# EAGLE design observer (EAGLE 6.5.0)
AUTHOR: Brad Campbell; REV: A; TITLE: Observer
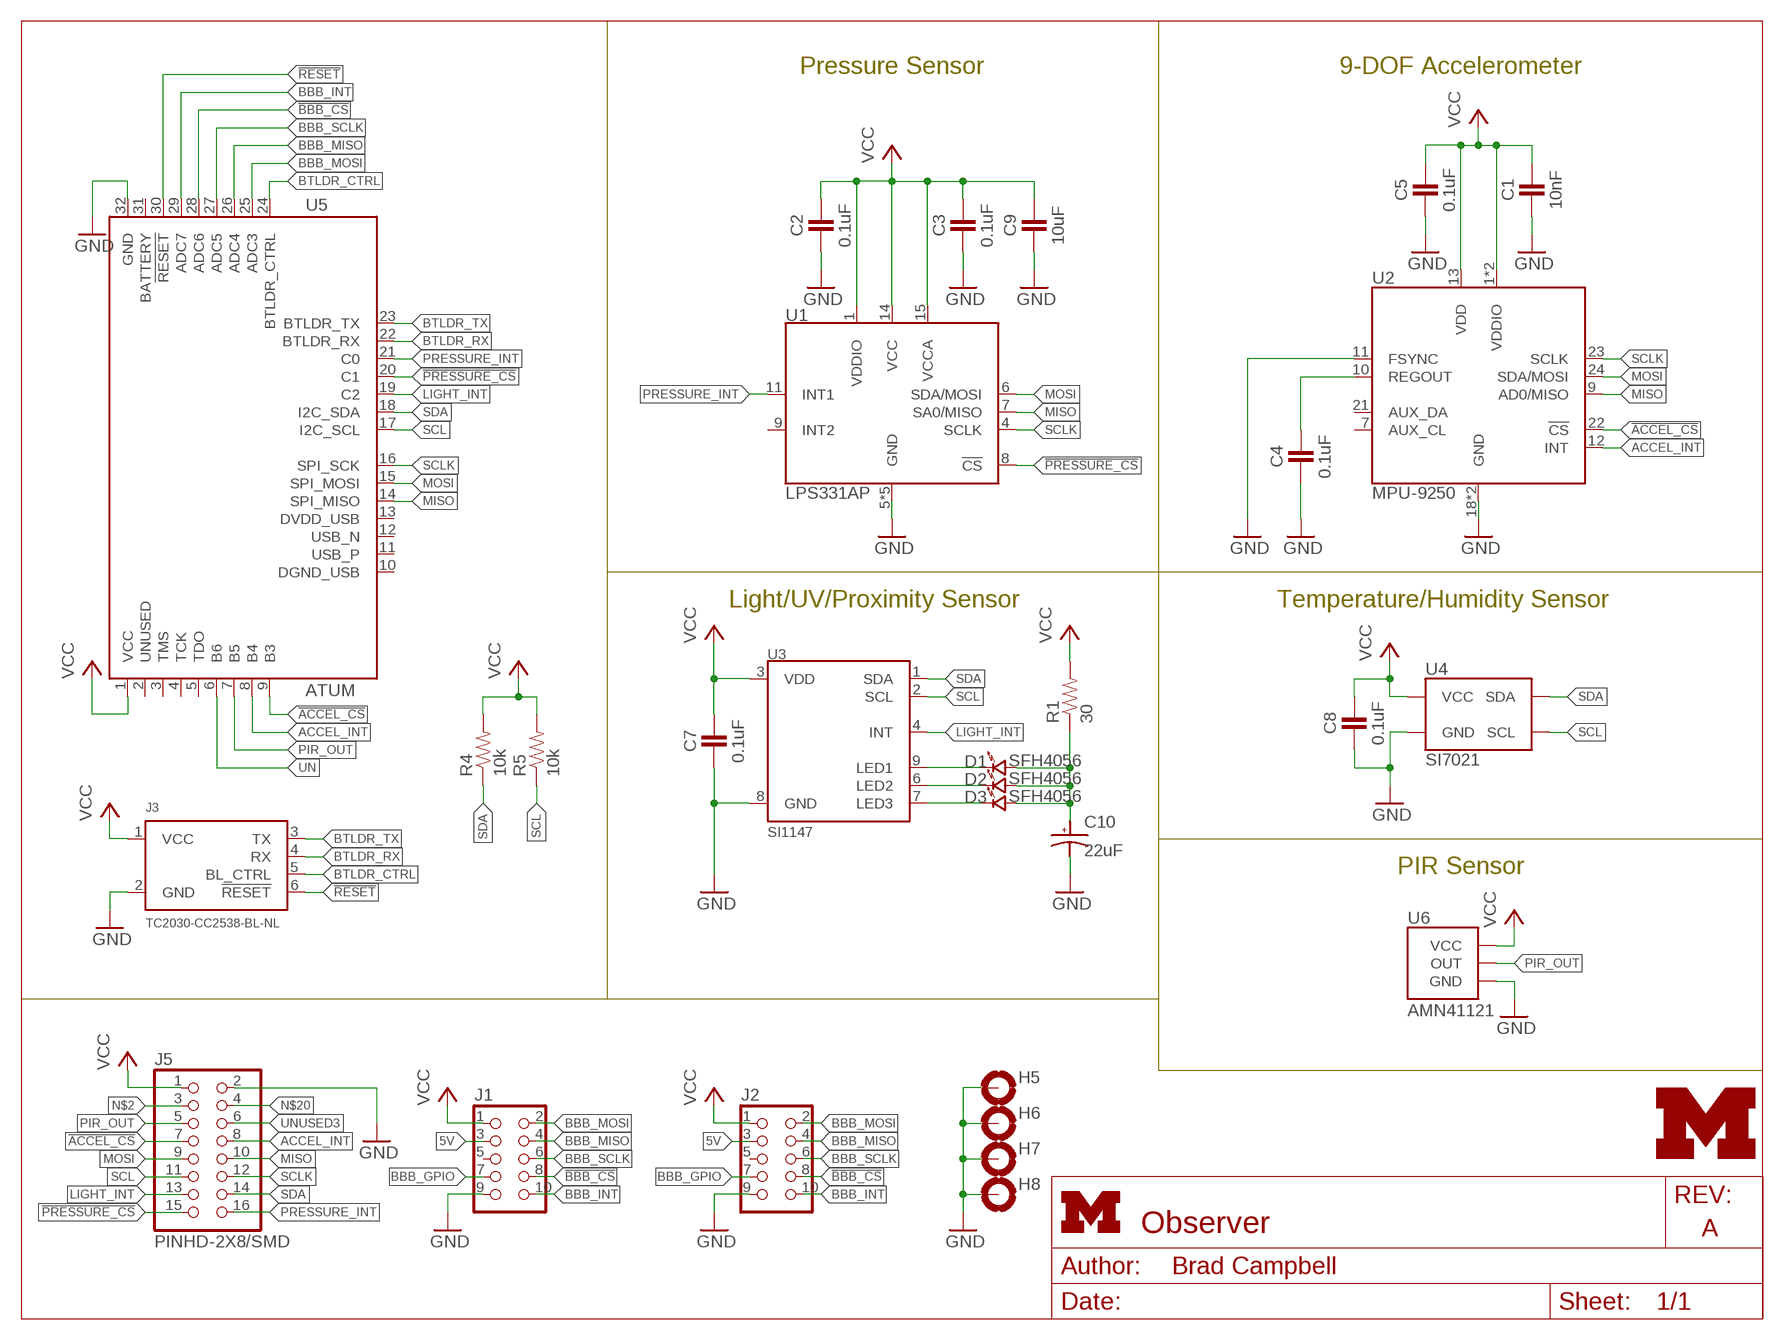
[diagram p0: schematic, sheet 1]
FRAME1 (LETTER_L): HEIGHT: 8.5in; WIDTH: 11in

## Parts
C1  10nF  CAPACITOR  [0402_CAP]
C2  0.1uF  CAPACITOR  [0402_CAP]
C3  0.1uF  CAPACITOR  [0402_CAP]
C4  0.1uF  CAPACITOR  [0402_CAP]
C5  0.1uF  CAPACITOR  [0402_CAP]
C7  0.1uF  CAPACITOR  [0402_CAP]
C8  0.1uF  CAPACITOR  [0402_CAP]
C9  10uF  CAPACITOR  [0402_CAP]
C10  22uF  CAP_POL0603  [CAP0603]
D1  SFH4056  [SFH4056]
D2  SFH4056  [SFH4056]
D3  SFH4056  [SFH4056]
H5  MOUNT-PAD-ROUND3.2  [3,2-PAD]
H6  MOUNT-PAD-ROUND3.2  [3,2-PAD]
H7  MOUNT-PAD-ROUND3.2  [3,2-PAD]
H8  MOUNT-PAD-ROUND3.2  [3,2-PAD]
J1  CON_HEADER_2X05-SMD+SHROUDED  [PINSHRD_SMT_2X05]
J2  CON_HEADER_2X05-SMD+SHROUDED  [PINSHRD_SMT_2X05]
J3  TC2030-CC2538-BL-NL  [TC2030-IDC-NL]
J5  PINHD-2X8/SMD  [2X8/SMD]
LOGO1  UMICH_SOLID_TINY  [UMICH_SOLID_50MIL]
R1  30  RESISTOR0402_RES  [0402_RES]
R4  10k  RESISTOR0402_RES  [0402_RES]
R5  10k  RESISTOR0402_RES  [0402_RES]
U1  LPS331AP  [HCLGA-16/3MM]
U2  MPU-9250  [QFN-24/3MM]
U3  SI1147  [QFN-10/2MM]
U4  SI7021  [DFN-6/3MM]
U5  ATUM  [ATUM]
U6  AMN41121  [AMN2]

## Nets
5V: J1.3 J2.3
!ACCEL_CS: J5.7 U2.22(!CS) U5.9(B3)
!BBB_CS: J1.8 J2.8 U5.28(ADC6)
!PRESSURE_CS: J5.15 U1.8(!CS) U5.20(C1)
!RESET: J3.6(!RESET) U5.30(!RESET)
ACCEL_INT: J5.8 U2.12(INT) U5.8(B4)
BBB_GPIO: J1.7 J2.7
BBB_INT: J1.10 J2.10 U5.29(ADC7)
BBB_MISO: J1.4 J2.4 U5.26(ADC4)
BBB_MOSI: J1.2 J2.2 U5.25(ADC3)
BBB_SCLK: J1.6 J2.6 U5.27(ADC5)
BTLDR_CTRL: J3.5(BL_CTRL) U5.24(BTLDR_CTRL)
BTLDR_RX: J3.4(RX) U5.22(BTLDR_RX)
BTLDR_TX: J3.3(TX) U5.23(BTLDR_TX)
GND: C1.2 C2.2 C3.2 C4.2 C5.2 C7.2 C8.2 C9.2 C10.NEG(ANODE) H5.B3,2(MOUNT) H6.B3,2(MOUNT) H7.B3,2(MOUNT) H8.B3,2(MOUNT) J1.9 J2.9 J3.2(GND) J5.2 U1.5(GND) U1.10(GND) U1.12(GND) U1.13(GND) U1.16(GND) U2.11(FSYNC) U2.18(GND) U2.20(GND) U3.8(GND) U4.2(GND) U5.32(GND) U6.GND
LIGHT_INT: J5.13 U3.4(INT) U5.19(C2)
MISO: J5.10 U1.7(SA0/MISO) U2.9(AD0/MISO) U5.14(SPI_MISO)
MOSI: J5.9 U1.6(SDA/MOSI) U2.24(SDA/MOSI) U5.15(SPI_MOSI)
N$2: J5.3
N$3: C4.1 U2.10(REGOUT)
N$4: D1.CATHODE U3.9(LED1)
N$6: D2.CATHODE U3.6(LED2)
N$7: D3.CATHODE U3.7(LED3)
N$8: C10.POS(CATHODE) D1.ANODE D2.ANODE D3.ANODE R1.1
N$20: J5.4
PIR_OUT: J5.5 U5.7(B5) U6.OUT
PRESSURE_INT: J5.16 U1.11(INT1) U5.21(C0)
SCL: J5.11 R5.1 U3.2(SCL) U4.6(SCL) U5.17(I2C_SCL)
SCLK: J5.12 U1.4(SCLK) U2.23(SCLK) U5.16(SPI_SCK)
SDA: J5.14 R4.1 U3.1(SDA) U4.1(SDA) U5.18(I2C_SDA)
UN: U5.6(B6)
UNUSED3: J5.6
VCC: C1.1 C2.1 C3.1 C5.1 C7.1 C8.1 C9.1 J1.1 J2.1 J3.1(VCC) J5.1 R1.2 R4.2 R5.2 U1.1(VDDIO) U1.14(VCC) U1.15(VCCA) U2.1(VDDIO) U2.8(VDDIO) U2.13(VDD) U3.3(VDD) U4.5(VCC) U5.1(VCC) U6.VCC
Unconnected: J1.5 J2.5 U1.9(INT2) U2.7(AUX_CL) U2.21(AUX_DA) U5.2(UNUSED) U5.3(TMS) U5.4(TCK) U5.5(TDO) U5.10(DGND_USB) U5.11(USB_P) U5.12(USB_N) U5.13(DVDD_USB) U5.31(BATTERY)

## Notes on the sheet
- Pressure Sensor | 9-DOF Accelerometer
- Light/UV/Proximity Sensor | Temperature/Humidity Sensor
- PIR Sensor

## Library data of the parts
C1 = passives:CAPACITOR: 0402 Capacitor; DIGIKEY: 490-1312-1-ND
C2-C5 C7 C8 = passives:CAPACITOR: 0402 Capacitor; DIGIKEY: 490-1318-1-ND
C9 = passives:CAPACITOR: 0402 Capacitor; DIGIKEY: 445-8919-1-ND
C10 = passives:CAP_POL; DIGIKEY: 511-1493-1-ND
D1-D3 = leds:SFH4056: LED IR EMITTER 850NM; DIGIKEY: 475-3042-1-ND
H5-H8 = holes:MOUNT-PAD-ROUND: MOUNTING PAD, round
J1 J2 = dp_devices:CON_HEADER_2X05: 2x05 pin header; DIGIKEY: S9185-ND
J3 = connector:TC2030-CC2538-BL: Tag connect programmer for the CC2538 bootloader. The RX/TX switch happens on the programmer board, so when using this connect the TX pin to the TX pin on the CC2538 and same for the RX.
J5 = headers:PINHD-2X8/SMD
LOGO1 = logos:UMICH_SOLID
R1 = passives:RESISTOR: Resistor Basic schematic elements and footprints for 0603, 1206, and PTH resistors.; DIGIKEY: RHM30CECT-ND
R4 R5 = passives:RESISTOR: Resistor Basic schematic elements and footprints for 0603, 1206, and PTH resistors.; DIGIKEY: RHM10.0KCDCT-ND
U1 = chips:LPS331AP: IC PRESSURE SENSOR PIEZO 16HCLGA; DIGIKEY: 497-12927-1-ND
U2 = chips:MPU-9250: GYRO/ACCEL/COMPASS/9-AXIS; DIGIKEY: 1428-1019-1-ND
U3 = chips:SI1147: SENSOR DGTL UV INDEX 10QFN; DIGIKEY: 336-2624-1-ND
U4 = chips:SI7021: IC TEMP SENSOR RH 2% DFN; DIGIKEY: 336-2542-1-ND
U5 = atum:ATUM: Atum sensorboard prototyping module.
U6 = chips:AMN: Passive infrared human detection sensor with built-in amp.; DIGIKEY: 255-2651-ND

## Board
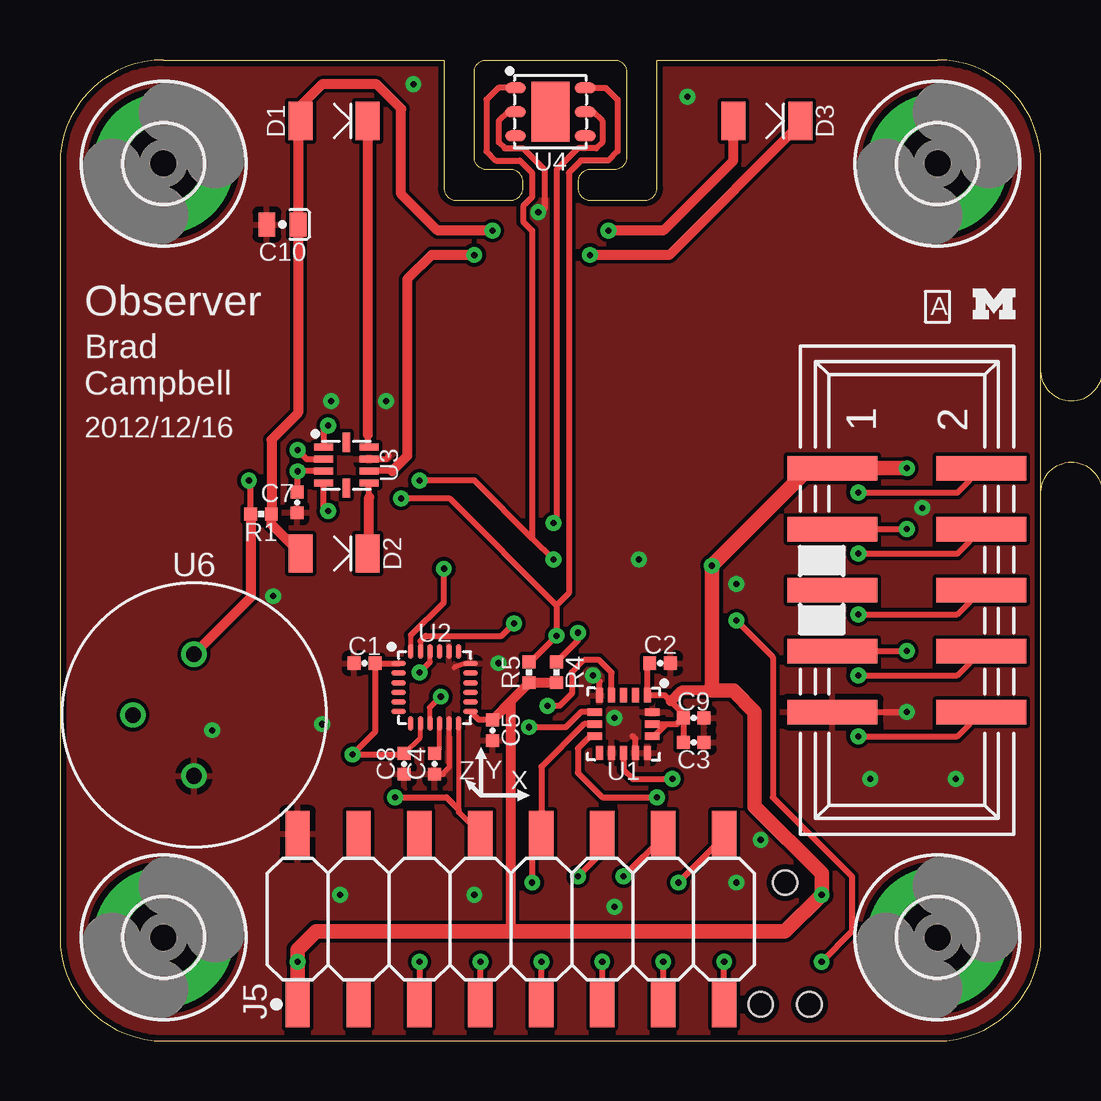
[diagram p1: board, top side]
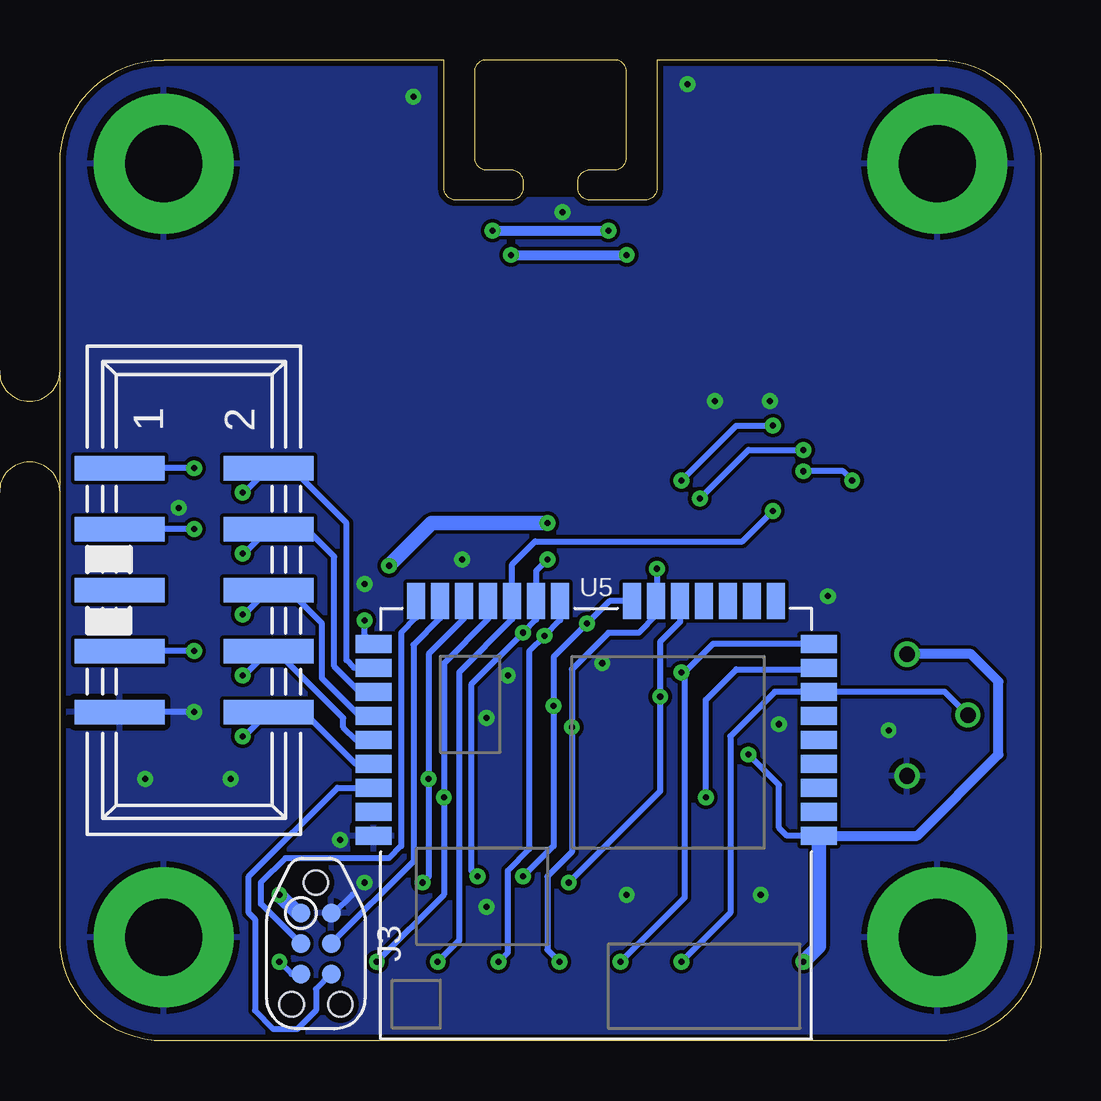
[diagram p2: board, bottom side, seen from below]

Size 40.89 x 40.89 mm. Coordinates in mm from the lower left corner, seen from the top.
Outline: 0,36.58 0,4.32 arc90 4.32,0 36.58,0 arc90 40.89,4.32 40.89,36.58 arc90 36.58,40.89 24.89,40.89 24.89,35.56 arc-90 24.38,35.05 22.1,35.05 arc-90 21.59,35.56 21.59,35.81 arc-90 22.1,36.32 23.11,36.32 arc90 23.62,36.83 23.62,40.39 arc90 23.11,40.89 17.78,40.89 arc90 17.27,40.39 17.27,36.83 arc90 17.78,36.32 18.8,36.32 arc-90 19.3,35.81 19.3,35.56 arc-90 18.8,35.05 16.51,35.05 arc-90 16,35.56 16,40.89 4.32,40.89 arc90 0,36.58
Copper layers (1*16): Top 0.0178mm / dielectric 59mil / Bottom 0.0178mm
Design rules "sunstone-2lyr_v1.0.0.3 *": minimum track width 6mil, minimum drill 14mil, track to track 6mil, track to pad 6mil, pad to pad 6mil, via to via 6mil, smd to smd 6mil, copper to edge 10mil, drill to drill 16mil, minimum pad ring 8mil, minimum via ring 8mil, stop-mask expansion 3mil, vias tented up to drill 20mil, thermal gap 10mil
Milling: 33 lines

### Footprints (pad centres in the part's own frame; a part is rotated, then mirrored left to right if it is on the bottom)
0402_CAP = smd 0.536 x 0.546: 1 -0.433,0; 2 0.433,0
CAP0603 = smd 0.7 x 1: NEG 0.65,0; POS -0.65,0
SFH4056 = smd 1 x 1.6: ANODE 1.4,0; CATHODE -1.4,0
3,2-PAD = drill 3.2 pad 5.842: B3,2 0,0
PINSHRD_SMT_2X05 = smd 1.02 x 3.75: 1 -5.08,-3.107; 2 -5.08,3.107; 3 -2.54,-3.107; 4 -2.54,3.107; 5 0,-3.107; 6 0,3.107; 7 2.54,-3.107; 8 2.54,3.107; 9 5.08,-3.107; 10 5.08,3.107
TC2030-IDC-NL = smd 0.787 x 0.787: 1 -1.27,-0.635; 2 -1.27,0.635; 3 0,-0.635; 4 0,0.635; 5 1.27,-0.635; 6 1.27,0.635 | hole 1.016: -2.54,0; 2.54,1.016; 2.54,-1.016
2X8/SMD = smd 1.016 x 1.905: 1 -8.89,-3.556; 2 -8.89,3.556; 3 -6.35,-3.556; 4 -6.35,3.556; 5 -3.81,-3.556; 6 -3.81,3.556; 7 -1.27,-3.556; 8 -1.27,3.556; 9 1.27,-3.556; 10 1.27,3.556; 11 3.81,-3.556; 12 3.81,3.556; 13 6.35,-3.556; 14 6.35,3.556; 15 8.89,-3.556; 16 8.89,3.556
0402_RES = smd 0.536 x 0.546: 1 -0.433,0; 2 0.433,0
HCLGA-16/3MM = smd 0.6 x 0.3: 1 -1.2,1; 2 -1.2,0.5; 3 -1.2,0; 4 -1.2,-0.5; 5 -1.2,-1; 9 1.2,-1; 10 1.2,-0.5; 11 1.2,0; 12 1.2,0.5; 13 1.2,1 | smd 0.3 x 0.6: 6 -0.5,-1.2; 7 0,-1.2; 8 0.5,-1.2; 14 0.5,1.2; 15 0,1.2; 16 -0.5,1.2
QFN-24/3MM = smd 0.6 x 0.23: 1 -1.5,1; 2 -1.5,0.6; 3 -1.5,0.2; 4 -1.5,-0.2; 5 -1.5,-0.6; 6 -1.5,-1; 13 1.5,-1; 14 1.5,-0.6; 15 1.5,-0.2; 16 1.5,0.2; 17 1.5,0.6; 18 1.5,1 | smd 0.23 x 0.6: 7 -1,-1.5; 8 -0.6,-1.5; 9 -0.2,-1.5; 10 0.2,-1.5; 11 0.6,-1.5; 12 1,-1.5; 19 1,1.5; 20 0.6,1.5; 21 0.2,1.5; 22 -0.2,1.5; 23 -0.6,1.5; 24 -1,1.5
QFN-10/2MM = smd 0.8 x 0.3: 1 -0.95,0.75; 2 -0.95,0.25; 3 -0.95,-0.25; 4 -0.95,-0.75; 6 0.95,-0.75; 7 0.95,-0.25; 8 0.95,0.25; 9 0.95,0.75 | smd 0.3 x 0.8: 5 0,-0.95; 10 0,0.95
DFN-6/3MM = smd 0.85 x 0.45: 1 -1.45,1; 2 -1.45,0; 3 -1.45,-1; 4 1.45,-1; 5 1.45,0; 6 1.45,1 | smd 1.6 x 2.5: P$1 0,0
ATUM = smd 0.754 x 1.5: 1 -9.479,-9.279; 2 -8.479,-9.279; 3 -7.479,-9.279; 4 -6.479,-9.279; 5 -5.479,-9.279; 6 -4.479,-9.279; 7 -3.479,-9.279; 8 -2.479,-9.279; 9 -1.479,-9.279; 24 -1.479,9.279; 25 -2.479,9.279; 26 -3.479,9.279; 27 -4.479,9.279; 28 -5.479,9.279; 29 -6.479,9.279; 30 -7.479,9.279; 31 -8.479,9.279; 32 -9.479,9.279 | smd 1.5 x 0.754: 10 0.3,-7.5; 11 0.3,-6.5; 12 0.3,-5.5; 13 0.3,-4.5; 14 0.3,-3.5; 15 0.3,-2.5; 16 0.3,-1.5; 17 0.3,1.5; 18 0.3,2.5; 19 0.3,3.5; 20 0.3,4.5; 21 0.3,5.5; 22 0.3,6.5; 23 0.3,7.5
AMN2 = drill 0.65: GND 1.796,-1.796; OUT -1.796,-1.796; VCC -1.796,1.796

### Placement (x,y rotation side)
C1  12.7,15.75 180 top
C2  25.02,15.75 0 top
C3  26.42,12.45 0 top
C4  15.62,11.56 270 top
C5  18.03,12.95 270 top
C7  9.88,22.45 270 top
C8  14.35,11.56 270 top
C9  26.42,13.46 0 top
C10  9.27,34.04 180 top
D1  11.43,38.35 180 top
D2  11.43,20.32 180 top
D3  29.46,38.35 180 top
H5  4.32,4.32 0 top
H6  4.32,36.58 0 top
H7  36.58,36.58 0 top
H8  36.58,4.32 0 top
J1  35.31,18.8 270 bottom
J2  35.31,18.8 270 top
J3  30.23,4.06 270 bottom
J5  18.8,5.08 0 top
LOGO1  38.94,30.73 0 top
R1  8.38,21.97 180 top
R4  20.7,15.37 270 top
R5  19.56,15.37 270 top
U1  23.5,13.21 270 top
U2  15.62,14.73 0 top
U3  11.94,24 0 top
U4  20.45,38.73 0 top
U5  18.54,18.03 90 bottom
U6  5.59,13.59 315 top

### Tracks (layer width: path | path; a pad name or v marks a point on that pad's centre or on a via)
5V  (via drill 0.25)
  Top 0.254: J2.3 v35.31,21.34
  Bottom 0.254: v35.31,21.34 J1.3
!ACCEL_CS  (via drill 0.25)
  Top 0.203: 15.42,15.8 U2.22
  Top 0.254: 15.42,15.8 v14.99,15.37 | J5.7 v17.53,3.3
  Bottom 0.254: U5.9 13.67,16.55 14.86,15.37 | v14.99,15.37 14.86,15.37 | 14.86,15.37 14.86,5.97 v17.53,3.3
!BBB_CS  (via drill 0.25)
  Top 0.254: 38.61,16.26 J2.8 37.4,15.24 v33.27,15.24
  Bottom 0.254: U5.28 28.56,12.55 29.08,13.08 29.08,13.46 31.88,16.26 J1.8 33.22,15.24 v33.27,15.24
!PRESSURE_CS  (via drill 0.25)
  Top 0.254: v24.89,10.16 22.61,10.16 21.59,11.18 21.59,12.19 22.11,12.71 U1.8 | J5.15 v27.69,3.3
  Bottom 0.254: U5.20 23.04,17.6 24.89,15.75 v24.89,10.16 24.89,6.1 v27.69,3.3
!RESET
  Bottom 0.254: J3.6 30.23,2.16 30.23,1.27 30.99,0.51 32,0.51 32.77,1.27 32.77,5.08 33.02,5.33 33.02,6.86 29.32,10.55 U5.30
ACCEL_INT  (via drill 0.25)
  Top 0.203: U2.12 16.62,9.65 | 16.62,9.54 J5.8
  Top 0.254: 16.62,9.54 16.62,9.65 16.11,10.16 v13.97,10.16
  Bottom 0.254: v13.97,10.16 13.97,14.22 12.7,15.49 9.32,15.49 U5.8
BBB_GPIO  (via drill 0.25)
  Top 0.254: J2.7 v35.31,16.26
  Bottom 0.254: v35.31,16.26 J1.7
BBB_INT  (via drill 0.25)
  Top 0.254: v33.27,12.7 37.4,12.7 J2.10
  Bottom 0.254: v33.27,12.7 33.22,12.7 J1.10 30.73,13.72 28.57,11.55 U5.29
BBB_MISO  (via drill 0.25)
  Top 0.254: v33.27,20.32 37.4,20.32 J2.4
  Bottom 0.254: v33.27,20.32 33.22,20.32 J1.4 30.61,21.34 29.46,20.19 29.46,15.62 28.4,14.55 U5.26
BBB_MOSI  (via drill 0.25)
  Top 0.254: v33.27,22.86 37.4,22.86 J2.2
  Bottom 0.254: U5.25 28.64,15.55 28.96,15.88 28.96,21.59 31.24,23.88 J1.2 33.22,22.86 v33.27,22.86
BBB_SCLK  (via drill 0.25)
  Top 0.254: v33.27,17.78 37.4,17.78 J2.6
  Bottom 0.254: U5.27 28.41,13.55 29.97,15.11 29.97,17.4 31.24,18.67 31.24,18.8 J1.6 33.22,17.78 v33.27,17.78
BTLDR_CTRL  (via drill 0.25)
  Top 0.254: v28.19,17.53 29.72,16 29.72,10.16 33.02,6.86 33.02,4.57 v31.75,3.3
  Bottom 0.254: U5.24 28.19,16.93 v28.19,17.53 | v31.75,3.3 31.24,2.79 J3.5
BTLDR_RX
  Bottom 0.254: U5.22 25.04,17.63 26.16,16.51 26.16,7.49 J3.4
BTLDR_TX
  Bottom 0.254: J3.3 32.51,5.71 32.51,6.6 31.5,7.62 27.18,7.62 26.67,8.13 26.67,17.02 26.04,17.65 U5.23
GND  (via drill 0.25)
  Top 0.203: U2.11 16.22,11.39 15.95,11.12 | U2.18 16.76,15.7 16.43,15.57
  Top 0.254: U4.2 18.67,38.73 18.29,38.35 18.29,37.47 18.54,37.21 19.3,37.21 20.19,36.32 20.19,34.67 | J2.9 v35.31,13.72 | 15.95,11.12 C4.2 | U1.5 22.5,14.97 v22.23,15.24 | U1.12 24,12.58 23.88,12.7 | U3.8 13.59,24.25 13.72,24.38
  Bottom 0.254: v35.31,13.72 J1.9 | J3.2 29.46,5.33 28.7,6.1
  other vias: 23.11,13.46 6.35,12.95 10.92,13.21 18.29,15.75 29.21,8.38 23.11,5.59 28.19,6.6 33.78,10.92 19.94,34.54 13.59,26.67 11.3,26.67 37.34,10.92 26.16,39.37 14.73,39.88 8.89,18.54 24.13,20.07 17.27,6.1 11.68,6.1 28.19,19.05 35.94,22.23
  pour Bottom: -1.27,42.16 16,42.16 16,35.05 24.89,35.05 24.89,42.16 42.42,42.16 42.42,-1.27 -1.27,-1.27
  pour Top: -1.27,42.16 16,42.16 16,35.05 24.89,35.05 24.89,42.16 42.42,42.16 42.42,-1.27 -1.27,-1.27
LIGHT_INT  (via drill 0.25)
  Top 0.254: J5.13 v25.15,3.3 | v11.18,22.1 10.99,22.29 U3.4
  Bottom 0.254: v25.15,3.3 24.26,4.19 24.26,15.37 22.04,17.58 U5.19 22.04,19.87 21.08,20.83 12.45,20.83 v11.18,22.1
MISO  (via drill 0.25)
  Top 0.203: U2.9 15.42,13.9
  Top 0.254: 15.42,13.9 v15.88,14.35 | v19.68,6.6 19.68,8.26 J5.10 20.07,11.43 21.84,13.21 U1.7
  Bottom 0.254: U5.14 15.04,17.47 15.88,16.64 v15.88,14.35 15.88,10.41 v19.68,6.6
MOSI  (via drill 0.25)
  Top 0.203: 14.62,16.91 U2.24
  Top 0.254: 14.62,16.91 16,18.29 v16,19.68 | J5.9 v20.07,3.3 | U1.6 21.71,13.71 21.08,13.08 v19.56,13.08
  Bottom 0.254: v16,19.68 16,18.37 U5.15 16.04,17.74 16.76,17.02 18.03,17.02 19.56,15.49 v19.56,13.08 19.56,7.87 20.57,6.86 20.57,3.81 v20.07,3.3
N$3
  Top 0.203: C4.1 15.82,12.17 U2.10
N$4
  Top 0.254: 12.83,25.27 12.83,24.81 U3.9
  Top 0.406: D1.CATHODE 12.83,25.27
N$6
  Top 0.254: 12.89,22.67 U3.6
  Top 0.406: D2.CATHODE 12.89,20.38 12.89,22.67
N$7  (via drill 0.25)
  Top 0.254: 13.85,23.75 U3.7
  Top 0.406: D3.CATHODE 30.86,38.23 25.4,32.77 v22.1,32.77 | v17.27,32.77 15.49,32.77 14.48,31.75 14.48,24.38 13.85,23.75
  Bottom 0.406: v22.1,32.77 v17.27,32.77
N$8  (via drill 0.25)
  Top 0.406: v22.86,33.78 25.15,33.78 28.06,36.7 D3.ANODE | v18.03,33.78 15.75,33.78 14.22,35.31 14.22,38.86 13.21,39.88 10.92,39.88 10.03,38.99 D1.ANODE 9.92,38.24 C10.POS 9.92,26.18 8.81,25.07 R1.1 8.81,21.54 D2.ANODE
  Bottom 0.406: v22.86,33.78 v18.03,33.78
PIR_OUT  (via drill 0.25)
  Top 0.254: v14.99,3.3 J5.5
  Bottom 0.254: U6.OUT 4.01,14.55 U5.7 11.1,14.55 12.95,12.7 12.95,5.33 v14.99,3.3
PRESSURE_INT  (via drill 0.25)
  Top 0.254: U1.11 23.5,11.3 23.88,10.92 v25.53,10.92 | v25.78,6.6 27.69,8.51 J5.16
  Bottom 0.254: U5.21 24.04,17.61 25.53,16.13 v25.53,10.92 25.53,6.86 v25.78,6.6
SCL  (via drill 0.25)
  Top 0.254: U4.6 22.75,39.73 23.24,39.24 23.24,37.08 22.86,36.7 21.72,36.7 21.21,36.2 21.21,18.67 20.7,18.16 | R5.1 19.56,15.75 v20.7,16.89 20.7,18.16 | J5.11 v22.61,3.3 | 20.7,18.16 16.26,22.61 v14.22,22.61 | v9.91,24.64 10.29,24.25 U3.2
  Bottom 0.254: U5.17 20.04,17.55 v20.7,16.89 21.34,16.26 21.34,8 22.23,7.11 22.23,3.68 v22.61,3.3 | v14.22,22.61 12.19,24.64 v9.91,24.64
SCLK  (via drill 0.25)
  Top 0.203: 15.02,16.67 U2.23
  Top 0.254: 15.02,16.67 15.24,16.89 18.41,16.89 v18.92,17.4 | J5.12 22.61,7.87 v21.59,6.86 | U1.4 23,15.36 22.48,15.88 21.84,15.88 21.34,15.37 21.34,14.48 20.83,13.97 v20.32,13.97
  Bottom 0.254: U5.16 17.99,18.33 v18.92,17.4 20.32,16 v20.32,13.97 20.32,8.13 v21.59,6.86
SDA  (via drill 0.25)
  Top 0.254: U4.1 18.27,39.73 17.78,39.24 17.78,37.08 18.16,36.7 19.18,36.7 19.68,36.2 19.68,35.18 19.3,34.8 19.3,34.16 19.68,33.78 19.68,20.95 | J5.14 25.15,8.51 v23.5,6.86 | v21.59,17.02 21.59,16.69 R4.1 | 19.68,20.95 v20.57,20.07 | 19.68,20.95 17.27,23.37 v14.99,23.37 | v11.18,25.65 10.99,25.47 U3.1
  Bottom 0.254: v23.5,6.86 23.75,7.11 23.75,14.86 v21.59,17.02 21.04,17.57 U5.18 21.04,19.6 v20.57,20.07 | v14.99,23.37 12.7,25.65 v11.18,25.65
VCC  (via drill 0.25)
  Top 0.203: C8.1 15.02,12.66 U2.8
  Top 0.254: U4.5 22.23,38.73 22.61,38.35 22.61,37.47 22.35,37.21 21.59,37.21 20.7,36.32 20.7,21.72 v20.57,21.59 | C2.1 24.5,15.66 U1.1 25.22,14.41 25.46,14.16 25.98,13.64 C9.1 | U1.15 25.27,13.21 | 25.27,13.21 25.73,13.21 C9.1 | C9.1 C3.1 | U1.14 24.77,12.71 25.27,13.21 | 14.11,15.75 U2.1 13.15,15.73 C1.1 13.13,12.88 v12.19,11.94 14.3,11.94 C8.1 | R1.2 7.95,23.29 v7.87,23.37 | C7.1 9.91,22.91 v9.91,23.75 U3.3 | C5.1 17.47,13.39 U2.13
  Top 0.406: R4.2 R5.2 18.8,14.17 | 18.8,4.57 18.8,14.17 | 27.18,14.61 25.91,14.61 25.46,14.16 | 18.8,14.17 18.49,13.87 18.49,13.84 C5.1 | R1.2 7.95,18.49 U6.VCC
  Top 0.61: v35.31,23.88 J2.1 31.24,23.88 v27.18,19.81 27.18,14.61 28.07,14.61 28.96,13.72 28.96,9.78 31.75,6.99 v31.75,6.1 30.23,4.57 18.8,4.57 10.67,4.57 9.91,3.81 v9.91,3.3 J5.1
  Bottom 0.254: v35.31,23.88 J1.1 | U5.1 10.59,8.55 10.92,8.89 10.92,10.67 v12.19,11.94 | v7.87,23.37 8.26,23.75 v9.91,23.75
  Bottom 0.406: U5.1 5.16,8.55 1.78,11.94 1.78,14.99 2.92,16.13 U6.VCC
  Bottom 0.61: U5.1 9.26,3.94 v9.91,3.3 | v31.75,6.1 30.99,5.33 J3.1 | v20.57,21.59 25.4,21.59 v27.18,19.81

### Text on the board
tPlace: A | Observer | Brad / Campbell | 2012/12/16 | Z | Y | X